# Altium schematic sheet khối cảm biến và khối khuếch đại.SchDoc
size A; SheetNumber: 1
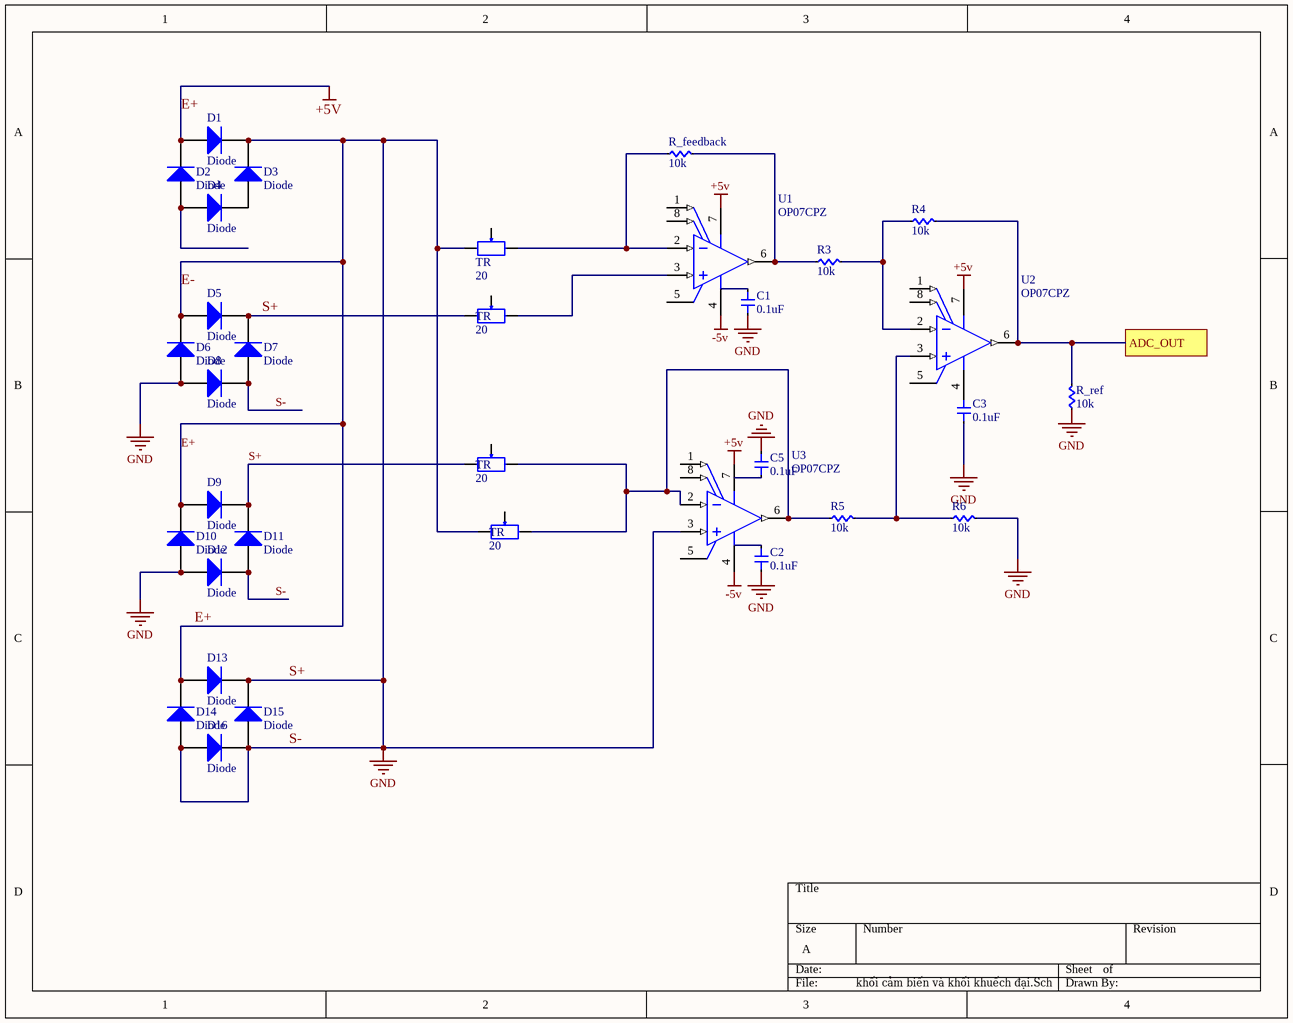
[diagram p0: khối cảm biến và khối khuếch đại.SchDoc]

## Parts
(Parts that share a designator on the sheet are numbered #1, #2 ... from top to bottom, then left to right.)
C1  0.1uF  [Cap 0201]
C2  0.1uF  [Cap 0201]
C3  0.1uF  [Cap 0201]
C5  0.1uF  [Cap 0201]
D1  Diode  [SMC]
D2  Diode  [SMC]
D3  Diode  [SMC]
D4  Diode  [SMC]
D5  Diode  [SMC]
D6  Diode  [SMC]
D7  Diode  [SMC]
D8  Diode  [SMC]
D9  Diode  [SMC]
D10  Diode  [SMC]
D11  Diode  [SMC]
D12  Diode  [SMC]
D13  Diode  [SMC]
D14  Diode  [SMC]
D15  Diode  [SMC]
D16  Diode  [SMC]
R3  10k  [RES 1206]
R4  10k  [RES 1206]
R5  10k  [RES 1206]
R6  10k  [RES 1206]
R_feedback  10k  [RES 1206]
R_ref  10k  [RES 1206]
TR#1  20  [Bien Tro Vi Chinh Dung]
TR#2  20  [Bien Tro Vi Chinh Dung]
TR#3  20  [Bien Tro Vi Chinh Dung]
TR#4  20  [Bien Tro Vi Chinh Dung]
U1  OP07CPZ  [ADI-N-8]
U2  OP07CPZ  [ADI-N-8]
U3  OP07CPZ  [ADI-N-8]

## Ports
ADC_OUT

## Nets
-5v: U1.4(-V) U3.4(-V)
E+: C1.2 C2.2 C3.2 C5.1 D1.1(A) D1.2(K) D2.2(K) D3.2(K) D5.1(A) D5.2(K) D6.1(A) D6.2(K) D7.1(A) D7.2(K) D8.1(A) D8.2(K) D9.1(A) D9.2(K) D10.1(A) D10.2(K) D11.1(A) D11.2(K) D12.1(A) D12.2(K) D13.1(A) D13.2(K) D14.1(A) D14.2(K) D15.1(A) D15.2(K) D16.1(A) D16.2(K) R6.2 R_ref.1 TR#1.1 TR#2.1 TR#3.1 TR#4.1 U1.7(+V) U2.7(+V) U3.3(+IN) U3.7(+V)  [also labelled +5v, E-, GND, S+, S-]
ADC_OUT: R4.2 R_ref.2 U2.6(OUT) ; port ADC_OUT
NetC3_1: C3.1 U2.4(-V)
NetD2_1: D2.1(A) D4.1(A)
NetD3_1: D3.1(A) D4.2(K)
NetR3_1: R3.1 R_feedback.2 U1.6(OUT)
NetR3_2: R3.2 R4.1 U2.2(-IN)
NetR5_1: R5.1 TR#3.3 TR#4.3 U3.2(-IN) U3.6(OUT)
NetR5_2: R5.2 R6.1 U2.3(+IN)
NetR_feedback_1: R_feedback.1 TR#1.3 U1.2(-IN)
NetTR#2_3: TR#2.3 U1.3(+IN)

Not connected (* = marked no-connect by the designer): C1 1; C2 1; C5 2; TR#1 2; TR#2 2; TR#3 2; TR#4 2; U1 1(VOS_TRIM) 5(NC) 8(VOS_TRIM); U2 1(VOS_TRIM) 5(NC) 8(VOS_TRIM); U3 1(VOS_TRIM) 5(NC) 8(VOS_TRIM)

## Library data of the parts
C1-C3 C5 = Cap 0201: Capacitor SMD 0201
D1-D16 = Diode: Default Diode; Published: 8-Jun-2000; LatestRevisionDate: 17-Jul-2002; LatestRevisionNote: Re-released for DXP Platform.; PackageVersion: Sep-1996; PackageReference: SMC; Publisher: Altium Limited; PackageDescription: DO-214-AB/SMC; 2 C-Bend Leads; Body 7.9 x 5.9 mm, inc. leads (LxW); Code_JEDEC: DO-214-AB
R3-R6 R_feedback R_ref = RES 1206: RES SMD 1206; Manufacturer: Vishay Dale; Manufacturer Part Number: CRCW040210K0FKED; Tolerance: ±1%; Power (Watts): 0.063W, 1/16W; Temperature Coefficient: ±100ppm/°C; Supplier 1: Digi-Key; RoHS: RoHS Compliant; Category: Resistors; Stock 1: 2392462; Pricing 1: 10=0.083, 50=0.0444, 200=0.0255, 1000=0.0174 (USD); Packaging: Cut Tape (CT); Resistance (Ohms): 10k; Composition: Thick Film; Features: Automotive AEC-Q200; Operating Temperature: -55°C ~ 155°C; Package / Case: 0402 (1005 Metric); Supplier Device Package: 0402 (1005 Metric); Size / Dimension: 0.039" L x 0.020" W (1.00mm x 0.50mm); Height: 0.016" (0.40mm); Number of Terminations: 2; ComponentLink1URL: http://www.vishay.com/docs/20035/dcrcwe3.pdf; ComponentLink1Description: http://www.vishay.com/docs/20035/dcrcwe3.pdf; Supplier Part Number 1: 541-10.0KLCT-ND
TR#1-TR#4 = Bien Tro Tinh Chinh 100R Dung: Cắm; Don_Vi: Con; Ten_Linh_Kien: Biến Trở VR 101-100R 3296W; Ma_Hang: MH003235; Kieu_Chan: *; Chung_Loai: Cắm
U1-U3 = CMP-0384-00212-1: Single Channel Low Noise Operational Amplifier, 600 KHz BW, 300 mV/us SR, Industrial, 8-pin DIP (N-8), Tube; Generic Part Number: OP07; Manufacturer: Analog Devices; # OpAmps per Pkg: 1; V Span Max: 44V; Small Signal Bandwidth: 600KHz; V Span Min: 6V; Mounting Technology: Through Hole; PackageVersion: 070606-A; PackageDescription: 8-Pin Plastic Dual In-Line Package, Row spacing 7.62 mm, Pitch 2.54 mm; PartNumber: OP07CPZ; PackageReference: N-8; ComponentLink3URL: http:/www.analog.com/static/imported-files/packages/PKG_PDF/PDIP(N)/N_8.pdf; Packing: Tube; ComponentLink3Description: Package Specification; ComponentLink1URL: http://www.analog.com/en/index.html; DatasheetVersion: Rev. G; ComponentLink2Description: Datasheet; Slew Rate: 300mV/us; Code_JEDEC: MS-001; ComponentLink1Description: Manufacturer URL; ComponentLink2URL: http://www.analog.com/static/imported-files/data_sheets/OP07.pdf